# EasyEDA Pro project ±1250V.epro, board PCB1
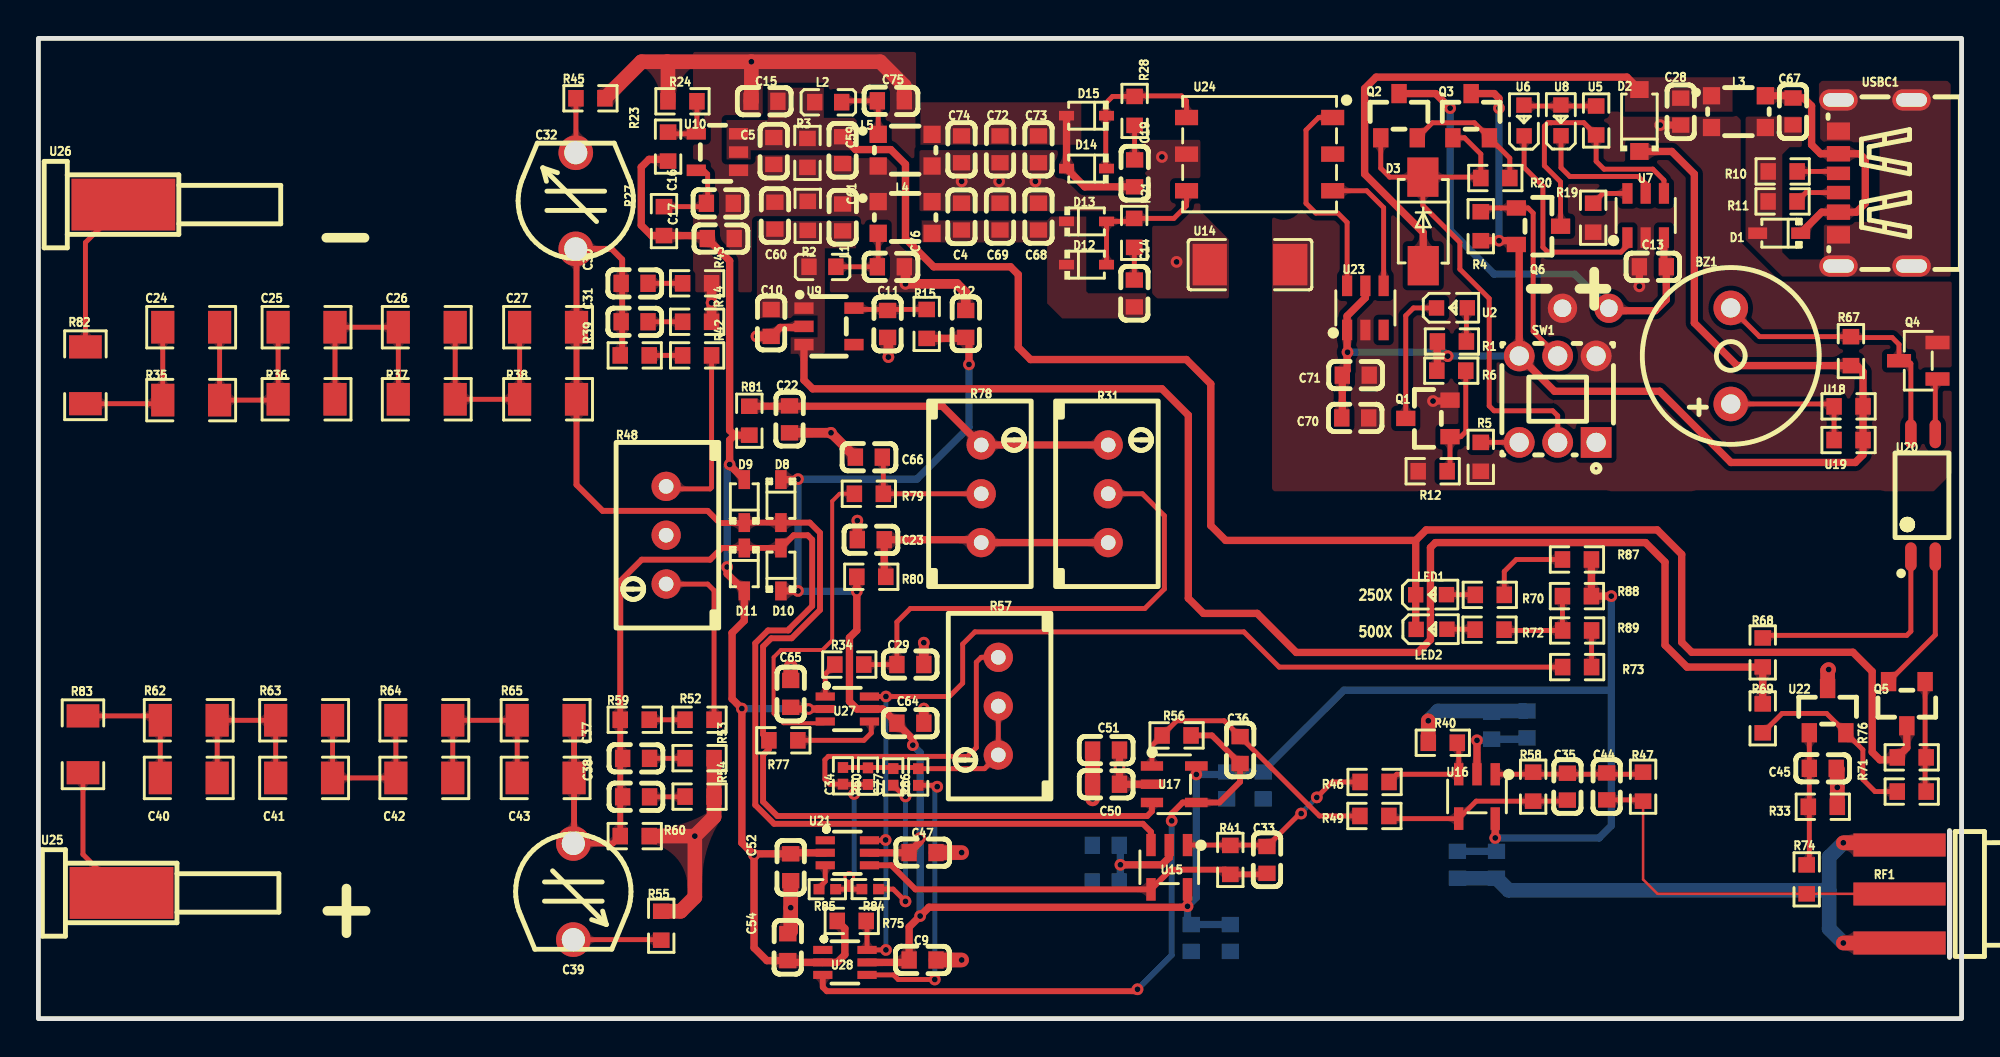
[diagram p3: board, top side]
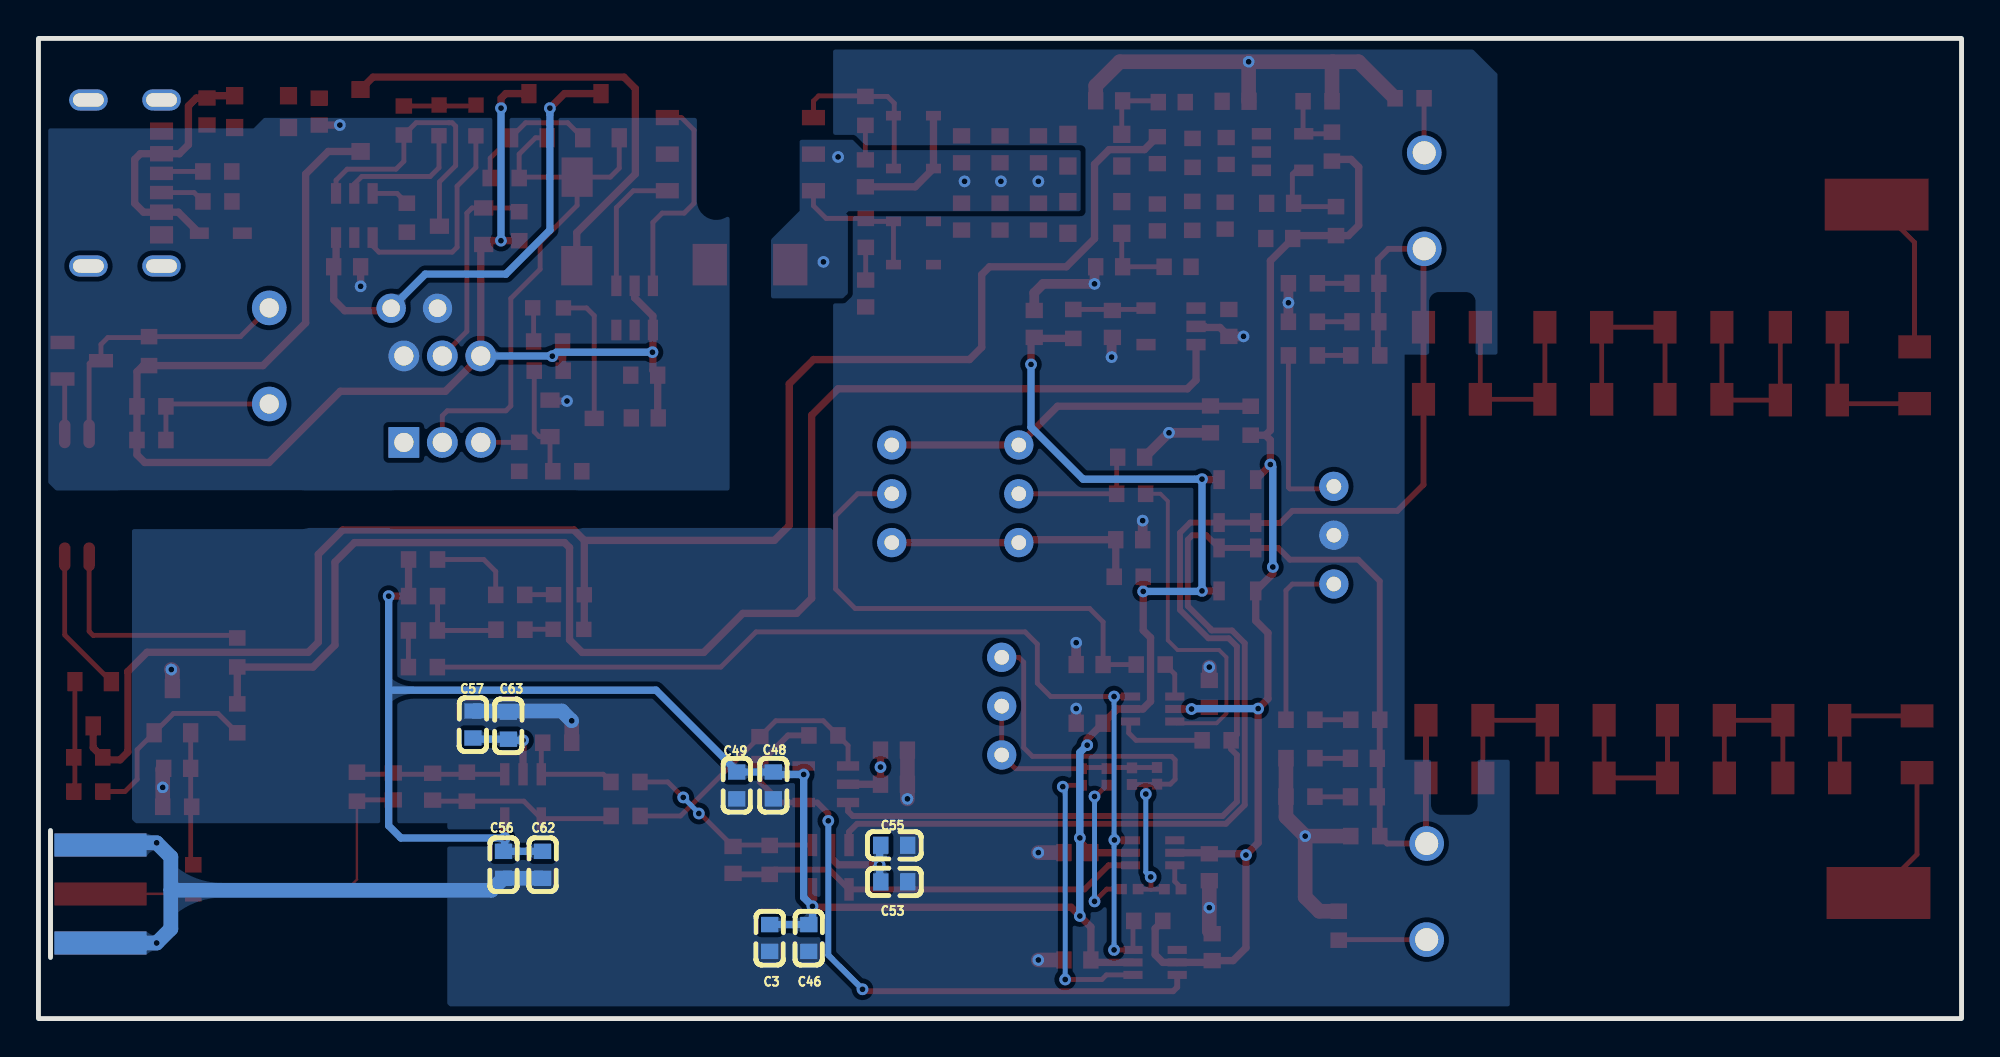
[diagram p4: board, bottom side, seen from below]

Outline 100 x 51 mm; copper layers: Top Layer, GND, PWR, Bottom Layer. Coordinates in mm from the lower left corner of the outline.
Outline path: rectangle 0,51 100,0
Stack: Top Layer 0.035mm 外层铜厚1oz / Dielectric1 0.0764mm 1080 RC67% 3.3mil / GND 0.0152mm 内层铜厚 / Dielectric2 1.265mm 1.3mm H/HOZ Copper / PWR 0.0152mm 内层铜厚 / Dielectric3 0.0764mm 1080 RC67% 3.3mil / Bottom Layer 0.035mm 外层铜厚1oz

## Design rules (mm)
net +2.5V: pwr
net SGND: pwr
net +VCC: pwr
net -4.5V: pwr
net +4.5V: pwr
net PGND: pwr
net BAT+: pwr
net -2.5V: pwr
net -VCC: pwr
net VSS_BIAS: pwr
net VCC_BIAS: pwr
net HV_IN-: SGN
net VBUS: pwr
net SIGNAL_A: SGN
net SIGNAL_D: SGN
net HV_IN+: SGN
net POWER_IN: pwr
net EGND: pwr
net +5V: pwr
template: 自定义配置
spacing copperThickness1oz (default): track to track 0.102, other pairs 0.152 to 0.3
spacing copperThickness2oz: track to track 0.203, other pairs 0.152 to 0.3
track width copperThickness1oz (default): min 0.025, default 0.254, max 2.54
track width pwr: min 0.203, default 0.381, max 2.54
track width sgn: min 0.127, default 0.305, max 2.54
track width GND: min 0.127, default 0.508, max 2.54
differential pair differentialPair (default): width min 0.127, default 0.254, max 2.54; gap min 0.152, default 0.152
via viaSize (default): diameter min 0.5, default 0.61, max 10; hole min 0.3, default 0.305, max 6.3
net class pwr uses pwr
net class SGN uses sgn
net +2.5V uses pwr
net GND uses GND
net SGND uses pwr
net +VCC uses pwr
net -4.5V uses pwr
net +4.5V uses pwr
net PGND uses pwr
net BAT+ uses pwr
net -2.5V uses pwr
net -VCC uses pwr
net VSS_BIAS uses pwr
net VCC_BIAS uses pwr
net HV_IN- uses sgn
net VBUS uses pwr
net SIGNAL_A uses sgn
net SIGNAL_D uses sgn
net HV_IN+ uses sgn
net POWER_IN uses pwr
net EGND uses pwr
net +5V uses pwr

## Placement (name value [footprint] x y rotation side)
BZ1  3kHz  [BUZ-TH_BD9.0-P5.00-D0.6-FD]  88 34.48 90 top
C3  1uF  [C0603]  61.98 4.19 90 bottom
C4  100nF  [C0603]  48 41.73 90 top
C5  22uF  [C0603]  38.24 45.14 90 top
C9  100nF  [C0603]  45.97 3.05 0 top
C10  10uF  [C0603]  38.1 36.19 90 top
C11  10uF  [C0603]  44.15 36.14 90 top
C12  10uF  [C0603]  48.22 36.14 270 top
C13  10uF  [C0603]  83.95 39.12 180 top
C14  1nF  [C0603]  56.98 37.73 270 top
C15  10uF  [C0603]  37.75 47.73 0 top
C16  10uF  [C0603]  35.43 42.42 180 top
C17  10uF  [C0603]  35.48 40.59 180 top
C19  1nF  [C0603]  57 43.98 270 top
C22  100nF  [C0603]  39.05 31.18 270 top
C23  100nF  [C0603]  43.28 24.91 180 top
C24  4.7pF  [R1206]  7.94 35.97 180 top
C25  4.7pF  [R1206]  13.94 35.97 180 top
C26  4.7pF  [R1206]  20.19 35.97 180 top
C27  2.2pF  [R1206]  26.5 35.97 180 top
C28  10uF  [C0603]  85.4 47.19 90 top
C29  100nF  [C0603]  45.34 18.42 0 top
C30  120pF  [C0603]  31 38.25 180 top
C31  100pF  [C0603]  31 36.25 180 top
C32  120pF  [CAP-TH_JML06]  27.94 42.55 90 top
C33  820pF  [C0603]  63.88 8.25 270 top
C34  100pF  [R0402]  41.83 12.63 270 top
C35  NC  [C0603]  79.5 12.06 270 top
C36  220pF  [C0603]  62.48 13.97 270 top
C37  120pF  [C0603]  31.08 13.54 0 top
C38  100pF  [C0603]  31.08 11.54 0 top
C39  120pF  [CAP-TH_JML06]  27.81 6.61 270 top
C40  4.7pF  [R1206]  7.81 12.52 180 top
C41  4.7pF  [R1206]  13.81 12.52 180 top
C42  4.7pF  [R1206]  20.06 12.52 180 top
C43  2.2pF  [R1206]  26.37 12.52 180 top
C44  22pF  [C0603]  81.55 12.08 90 top
C45  2.2pF  [C0603]  92.79 13.02 0 top
C46  1uF  [C0603]  59.94 4.19 90 bottom
C47  1uF  [C0603]  45.97 8.64 180 top
C48  100nF  [C0603]  61.79 12.13 270 bottom
C49  100nF  [C0603]  63.69 12.13 270 bottom
C50  100nF  [C0603]  55.51 12.19 180 top
C51  100nF  [C0603]  55.51 13.97 180 top
C52  1uF  [C0603]  39.12 7.87 90 top
C53  1uF  [C0603]  55.5 7.11 0 bottom
C54  100nF  [C0603]  38.97 3.71 90 top
C55  1uF  [C0603]  55.5 9.02 0 bottom
C56  100nF  [C0603]  73.79 8 270 bottom
C57  100nF  [C0603]  77.41 15.3 90 bottom
C59  22uF  [C0603]  41.82 45.18 90 top
C60  22uF  [C0603]  38.29 41.78 270 top
C61  22uF  [C0603]  41.82 41.68 270 top
C62  100nF  [C0603]  75.82 8 270 bottom
C63  100nF  [C0603]  75.57 15.24 90 bottom
C64  100nF  [C0603]  45.34 15.37 0 top
C65  100nF  [C0603]  39.12 16.89 90 top
C66  100nF  [C0603]  43.18 29.21 180 top
C67  10uF  [C0603]  91.24 47.2 90 top
C68  10uF  [C0603]  52 41.73 90 top
C69  10uF  [C0603]  50 41.73 90 top
C70  10uF  [C0603]  68.47 31.25 0 top
C71  100nF  [C0603]  68.5 33.48 0 top
C72  100nF  [C0603]  50 45.23 270 top
C73  10uF  [C0603]  52 45.23 270 top
C74  10uF  [C0603]  48 45.23 270 top
C75  22uF  [C0603]  44.32 47.75 180 top
C76  22uF  [C0603]  44.32 39.12 180 top
C77  47pF  [R0402]  44.45 12.57 270 top
D1  PESD5V0S1BA  [SOD-323_L1.7-W1.3-LS2.5-FD-1]  90.52 40.86 0 top
D2  B0520LW  [SOD-123_L2.7-W1.6-LS3.7-RD-4]  83.25 46.73 90 top
D3  SS34  [SMA_L4.3-W2.6-LS5.0-FD]  72 41.48 90 top
D8  1N4148WS  [SOD-323_L1.7-W1.3-LS2.5-FD-1]  38.61 26.92 90 top
D9  1N4148WS  [SOD-323_L1.7-W1.3-LS2.5-FD-1]  36.7 26.92 270 top
D10  1N4148WS  [SOD-323_L1.7-W1.3-LS2.5-FD-1]  38.61 23.37 270 top
D11  1N4148WS  [SOD-323_L1.7-W1.3-LS2.5-FD-1]  36.7 23.37 90 top
D12  B5819WS  [SOD-323_L1.7-W1.3-LS2.5-FD]  54.5 39.23 180 top
D13  B5819WS  [SOD-323_L1.7-W1.3-LS2.5-FD]  54.5 41.48 180 top
D14  B5819WS  [SOD-323_L1.7-W1.3-LS2.5-FD]  54.5 44.23 0 top
D15  B5819WS  [SOD-323_L1.7-W1.3-LS2.5-FD]  54.5 46.98 0 top
L1  2KΩ  [L0603]  40.77 39.12 180 top
L2  2KΩ  [L0603]  41.07 47.68 180 top
L3  WCM3225F2SF-601T10  [FILTER-SMD_4P-L3.2-W2.5-TL_PCAQ3225A]  88.4 47.19 0 top
L4  WCM3225F2SF-601T10  [FILTER-SMD_4P-L3.2-W2.5-TL_PCAQ3225A]  45.07 41.68 0 top
L5  WCM3225F2SF-601T10  [FILTER-SMD_4P-L3.2-W2.5-TL_PCAQ3225A]  45.07 45.18 0 top
LED1  GREEN  [LED0603-RD_GREEN]  72.42 22.05 0 top
LED2  BLUE  [LED0603-RD]  72.44 20.25 0 top
NOREF  -  [Pad_e197]  79.25 36.96 0 top
NOREF#2  -  [Pad_e196]  81.66 36.96 0 top
Q1  SS8050  [SOT-23_L2.9-W1.3-P1.90-LS2.4-BR]  72.25 31.23 0 top
Q2  AO3401A  [SOT-23_L2.9-W1.3-P1.90-LS2.4-BR]  70.75 46.98 270 top
Q3  AO3401A  [SOT-23_L2.9-W1.3-P1.90-LS2.4-BR]  74.5 46.98 270 top
Q4  SS8050  [SOT-23-3_L2.9-W1.3-P1.90-LS2.4-BR]  97.75 34.23 0 top
Q5  S8550  [SOT-23_L2.9-W1.3-P1.90-LS2.4-BR]  97.15 16.38 90 top
Q6  AO3401A  [SOT-23_L2.9-W1.3-P1.90-LS2.4-BR]  78 41.23 180 top
R1  1kΩ  [R0603]  73.5 35.23 0 top
R2  330Ω  [R0603]  40 41.77 270 top
R3  330Ω  [R0603]  39.99 45.04 90 top
R4  100kΩ  [R0603]  75 41.23 270 top
R5  47kΩ  [R0603]  75 29.23 90 top
R6  27kΩ  [R0603]  73.47 33.71 180 top
R10  5.1kΩ  [R0603]  90.7 44.08 0 top
R11  5.1kΩ  [R0603]  90.69 42.52 0 top
R12  4.7kΩ  [R0603]  72.5 28.48 0 top
R15  0Ω  [R0603]  46.19 36.14 270 top
R19  4.7kΩ  [R0603]  80.84 41.67 90 top
R20  100kΩ  [R0603]  75.76 43.73 180 top
R21  22Ω  [R0603]  56.98 40.88 270 top
R23  120kΩ  [R0603]  32.74 45.37 270 top
R24  110kΩ  [R0603]  33.49 47.73 180 top
R27  0Ω  [R0603]  32.53 41.49 270 top
R28  22Ω  [R0603]  57 47.23 270 top
R31  10KΩ  [RES-ADJ-TH_3296W]  55.63 27.3 0 top
R33  10kΩ  [R0603]  92.79 11.02 180 top
R34  10kΩ  [R0603]  42.16 18.42 0 top
R35  1MΩ  [R1206]  7.94 32.18 0 top
R36  1MΩ  [R1206]  13.94 32.22 0 top
R37  1MΩ  [R1206]  20.19 32.22 0 top
R38  1MΩ  [R1206]  26.5 32.22 0 top
R39  7.5kΩ  [R0603]  31.01 34.5 180 top
R40  402Ω  [R0603]  73.02 14.35 180 top
R41  402Ω  [R0603]  61.98 8.25 90 top
R42  402Ω  [R0603]  34.25 34.5 180 top
R43  10Ω  [R0603]  34.25 38.25 180 top
R44  10Ω  [R0603]  34.25 36.25 180 top
R45  10Ω  [R0603]  28.7 47.88 180 top
R46  402Ω  [R0603]  69.48 12.31 0 top
R47  50Ω  [R0603]  83.44 12.06 270 top
R48  500Ω  [RES-ADJ-TH_3296W]  32.64 25.15 180 top
R49  402Ω  [R0603]  69.47 10.54 0 top
R50  3.3kΩ  [R0402]  43.14 12.61 90 top
R52  402Ω  [R0603]  34.38 15.55 0 top
R53  10Ω  [R0603]  34.38 13.55 0 top
R54  10Ω  [R0603]  34.38 11.55 0 top
R55  10Ω  [R0603]  32.39 4.83 90 top
R56  402Ω  [R0603]  59.18 14.73 180 top
R57  20KΩ  [RES-ADJ-TH_3296W]  49.91 16.26 180 top
R58  402Ω  [R0603]  77.72 12.06 90 top
R59  7.5kΩ  [R0603]  31.01 15.55 0 top
R60  NC  [R0603]  31.01 9.49 0 top
R62  1MΩ  [R1206]  7.81 15.52 0 top
R63  1MΩ  [R1206]  13.81 15.52 0 top
R64  1MΩ  [R1206]  20.06 15.52 0 top
R65  1MΩ  [R1206]  26.37 15.52 0 top
R67  2.2kΩ  [R0603]  94.25 34.73 270 top
R68  2.2kΩ  [R0603]  89.66 19.05 270 top
R69  1kΩ  [R0603]  89.66 15.62 90 top
R70  2.2kΩ  [R0603]  75.47 22.05 180 top
R71  1kΩ  [R0603]  97.41 11.81 180 top
R72  2.2kΩ  [R0603]  75.46 20.23 180 top
R73  2.2kΩ  [R0603]  80.01 18.29 0 top
R74  5.1kΩ  [R0603]  91.95 7.24 90 top
R75  2.2kΩ  [R0603]  42.29 5.08 0 top
R76  18kΩ  [R0603]  97.41 13.59 0 top
R77  330kΩ  [R0603]  38.73 14.48 180 top
R78  10KΩ  [RES-ADJ-TH_3296W]  49.02 27.3 0 top
R79  10kΩ  [R0603]  43.18 27.3 0 top
R80  22Ω  [R0603]  43.31 22.99 0 top
R81  22Ω  [R0603]  36.97 31.11 90 top
R82  1kΩ  [R1206]  2.44 33.47 270 top
R83  1kΩ  [R1206]  2.31 14.27 90 top
R84  100Ω  [R0402]  43.25 6.74 0 top
R85  10Ω  [R0402]  41.02 6.73 0 top
R86  10Ω  [R0402]  45.75 12.57 270 top
R87  NC(250X)  [R0603]  80 23.88 180 top
R88  NC(500X)  [R0603]  80 21.98 180 top
R89  500x  [R0603]  80.01 20.19 180 top
RF1  BWSMA-KE-P001  [SMA-SMD_BWSMA-KE-P001]  96.77 6.48 0 top
SW1  TK-6580-1  [SW-TH_TK-6580-1]  79 32.23 270 top
U2  pwr  [LED0603-RD]  73.5 36.98 0 top
U5  1kΩ  [R0603]  81 46.73 90 top
U6  RED  [LED0603-RD]  77.25 46.73 90 top
U7  TP4057  [SOT-23-6_L2.9-W1.6-P0.95-LS2.8-BL]  83.58 41.78 0 top
U8  GREED  [LED0603-RD]  79.17 46.73 90 top
U9  ME6211C25M5G-N  [SOT-23-5_L3.0-W1.7-P0.95-LS2.8-BR]  41.11 36.02 180 top
U10  SGM2209-ADJXN5G/TR  [SOT-23-5_L2.9-W1.6-P0.95-LS2.8-BL]  35.31 45.08 90 top
U14  1nF  [C1808]  63 39.23 0 top
U15  SGM8061XN5/TR  [SOT-23-5_L3.0-W1.7-P0.95-LS2.8-BL]  58.8 7.87 180 top
U16  SGM8061XN5/TR  [SOT-23-5_L3.0-W1.7-P0.95-LS2.8-BL]  74.8 11.56 180 top
U17  SGM8061XN5/TR  [SOT-23-5_L3.0-W1.7-P0.95-LS2.8-BL]  59.05 12.19 270 top
U18  200Ω  [R0603]  94.12 31.85 0 top
U19  200Ω  [R0603]  94.12 30.1 0 top
U20  JC3H7C  [OPTO-SMD-4_L4.4-W2.7-P1.27-LS7.0-BR]  98 27.23 270 top
U21  BL1551B  [SC-70-6_L2.1-W1.3-P0.65-LS2.3-BR]  42.06 8.63 180 top
U22  TL432  [SOT-23_L2.9-W1.3-P1.90-LS2.4-BR]  93.04 16.02 270 top
U23  VPS8702  [SOT-23-6_L2.9-W1.6-P0.95-LS2.8-BL]  69 36.98 0 top
U24  0505 1W  [XFMR-SMD_6P-L8.0-W6.0-P1.91-LS8.4-TL]  63.5 44.98 270 top
U25  2mm香蕉头  [2MM香蕉头母座]  6.35 6.54 0 top
U26  2mm香蕉头  [2MM香蕉头母座]  6.45 42.35 0 top
U27  BL1551B  [SC-70-6_L2.1-W1.3-P0.65-LS2.3-BR]  42.06 16.11 180 top
U28  BL1551B  [SC-70-6_L2.1-W1.3-P0.65-LS2.3-BR]  41.94 2.92 180 top
USBC1  USB 3.1 C 6PF  [USB-C-SMD_TYPE-C-USB-13]  95.5 43.48 90 top

## Footprints (pads in the part's own frame, mm; a bottom-side part is the same pattern mirrored in y, then rotated)
2MM香蕉头母座
  rect 5.4x2.7 smd: 1(-2.032,0)
BUZ-TH_BD9.0-P5.00-D0.6-FD
  round 1.8 hole 1: 1(-2.5,0) 2(2.5,0)
C0603
  rect 0.8x0.9 smd: 1(-0.7,0) 2(0.7,0)
C1808
  rect 1.785x2.16 smd: 1(-2.092,0) 2(2.092,0)
CAP-TH_JML06
  round 1.8 hole 1.2: 1(-2.5,0) 2(2.5,0)
FILTER-SMD_4P-L3.2-W2.5-TL_PCAQ3225A
  rect 0.9x0.9 smd: 1(-1.4,0.825) 2(1.4,0.825) 3(1.4,-0.825) 4(-1.4,-0.825)
L0603
  rect 0.8x0.864 smd: 1(-0.7,0) 2(0.7,0)
LED0603-RD
  rect 0.8x0.8 smd: 1(-0.799,-0.004) 2(0.799,0.004)
LED0603-RD_GREEN
  rect 0.8x0.8 smd: 1(-0.799,-0.004) 2(0.799,0.004)
OPTO-SMD-4_L4.4-W2.7-P1.27-LS7.0-BR
  oval 1.5x0.6 smd: 1(3.2,-0.635) 2(3.2,0.635) 3(-3.2,0.635) 4(-3.2,-0.635)
Pad_e196
  round 1.524 hole 0.914: 1(0,0)
Pad_e197
  round 1.524 hole 0.914: 2(0,0)
R0402
  rect 0.566x0.54 smd: 1(-0.433,0) 2(0.433,0)
R0603
  rect 0.806x0.864 smd: 1(-0.753,0) 2(0.753,0)
R1206
  rect 1.208x1.701 smd: 1(-1.479,0) 2(1.479,0)
RES-ADJ-TH_3296W
  round 1.524 hole 0.762: 1(0,2.54) 2(0,0) 3(0,-2.54)
SC-70-6_L2.1-W1.3-P0.65-LS2.3-BR
  rect 1x0.42 smd: 1(1.15,-0.65) 2(1.15,0) 3(1.15,0.65) 4(-1.15,0.65) 5(-1.15,0) 6(-1.15,-0.65)
SMA-SMD_BWSMA-KE-P001
  rect 4.8x1.2 smd: 1(0,-2.55) 2(0,2.55) 5(0,0)
  rect 4.8x1.2 smd far side: 3(0,2.55) 4(0,-2.55)
SMA_L4.3-W2.6-LS5.0-FD
  rect 2.046x1.62 smd: 1(-2.304,-0.009) 2(2.304,0.009)
SOD-123_L2.7-W1.6-LS3.7-RD-4
  rect 0.88x0.96 smd: 1(-1.61,0) 2(1.61,0)
SOD-323_L1.7-W1.3-LS2.5-FD
  rect 0.78x0.5 smd: 1(-1.04,0) 2(1.04,0)
SOD-323_L1.7-W1.3-LS2.5-FD-1
  rect 0.985x0.6 smd: 1(-1.117,0) 2(1.117,0)
SOT-23-3_L2.9-W1.3-P1.90-LS2.4-BR
  rect 1.25x0.7 smd: 1(1,-0.95) 2(1,0.95) 3(-1,0)
SOT-23-5_L2.9-W1.6-P0.95-LS2.8-BL
  rect 0.6x1 smd: 1(-0.95,-1.1) 2(0,-1.1) 3(0.95,-1.1) 4(0.95,1.1) 5(-0.95,1.1)
SOT-23-5_L3.0-W1.7-P0.95-LS2.8-BL
  rect 0.49x1.157 smd: 1(-0.95,-1.153) 2(0,-1.153) 3(0.95,-1.153)
  rect 0.49x1.175 smd: 4(0.95,1.153) 5(-0.95,1.153)
SOT-23-5_L3.0-W1.7-P0.95-LS2.8-BR
  rect 1x0.6 smd: 1(1.3,-0.95) 2(1.3,0) 3(1.3,0.95) 4(-1.3,0.95) 5(-1.3,-0.95)
SOT-23-6_L2.9-W1.6-P0.95-LS2.8-BL
  rect 0.532x1.072 smd: 1(-0.95,-1.149) 2(0,-1.149) 3(0.95,-1.149) 4(0.95,1.149) 5(0,1.149) 6(-0.95,1.149)
SOT-23_L2.9-W1.3-P1.90-LS2.4-BR
  rect 1x0.8 smd: 1(1.15,-0.95) 2(1.15,0.95) 3(-1.15,0)
SW-TH_TK-6580-1
  rect 1.6x1.6 hole 1: 1(2.25,2)
  round 1.6 hole 1: 2(2.25,0) 3(2.25,-2) 4(-2.25,2) 5(-2.25,0) 6(-2.25,-2)
USB-C-SMD_TYPE-C-USB-13
  oval 1.1x2 hole 0.7x1.6: 1(-4.32,1.899) 2(-4.32,-1.901) 3(4.32,-1.901) 4(4.32,1.899)
  rect 0.7x1.2 smd: A5(-0.5,1.897) B5(0.5,1.897)
  rect 0.8x1.2 smd: A9(-1.52,1.899) B9(1.52,1.901)
  rect 0.9x1.2 smd: A12(-2.7,1.899) B12(2.7,1.899)
XFMR-SMD_6P-L8.0-W6.0-P1.91-LS8.4-TL
  rect 0.8x1.2 smd: 1(-1.905,3.8) 2(0,3.8) 3(1.905,3.8) 4(1.905,-3.8) 5(0,-3.8) 6(-1.905,-3.8)

## Nets
As in the schematic, except:
PGND: C13.2 C28.1 C70.2 C71.2 L3.4 NOREF.2 Q1.2 Q4.2 R5.1 R12.1 R19.1 SW1.4 U7.2 U14.2 U23.2
BAT+: C13.1 NOREF#2.1 Q2.3 U7.3

Pads without a net: SW1 1; U9 4; U21 1; U23 3; U24 2; U28 1

## Via types
v1: diameter 0.61, hole 0.305, Top Layer to Bottom Layer, 65 vias

## Routing (per net, layer and track width the routed paths; a pad name or vN(x,y) marks a point on that pad's centre or on a via; arc(x,y) is an arc through that point)
+2.5V: length 129.3
  Top Layer w0.381: v1(39.5,28.07) 39.47,28.04 38.61,28.04 ; R87.1 R88.1 v1(81.79,21.98) ; U15.5 v1(59.75,5.84) 59.7,5.79 46.3,5.79 v1(45.85,5.33) 45.27,4.76 C9.1 45.15,2.92 U28.5 ; v1(48.39,34.04) 48.39,35.27 C12.2 48.17,35.39 R15.2 ; R80.1 v1(42.55,22.22) 42.55,20.2 42.17,19.82 42.17,16.5 42.57,16.11 U27.5 43.9,16.11 C64.1 45.47,14.54 v1(45.47,14.23) ; U21.5 45.26,8.63 C47.2 45.85,9.21 v1(45.85,9.4) ; U16.5 v1(75.75,9.4) ; U17.5 v1(60.21,12.7) ; D10.2 v1(39.5,22.25)
  Bottom Layer w0.381: 81.79,17.09 81.79,10.03 81.15,9.4 v1(75.75,9.4) 75.75,8.77 C62.1 C56.1 ; 81.79,17.09 67.89,17.09 63.69,12.89 C49.1 C48.1 61.66,12.7 v1(60.21,12.7) 60.21,6.3 v1(59.75,5.84) 59.75,5.08 C46.2 C3.2 ; 81.79,17.09 v1(81.79,21.98) ; v1(45.85,5.33) v1(45.85,9.4) 45.85,13.84 v1(45.47,14.23) ; v1(48.39,34.04) 48.39,30.77 45.68,28.07 v1(39.5,28.07) v1(39.5,22.25) 39.52,22.22 v1(42.55,22.22)
+4.5V: length 75.5
  Top Layer w0.381: U9.3 39.81,33.22 40.26,32.77 58.42,32.77 59.79,31.39 59.79,21.87 60.58,21.08 63.37,21.08 65.4,19.05 71.73,19.05 72.38,19.71 72.38,24.5 72.64,24.77 83.57,24.77 84.58,23.75 84.58,19.43 85.73,18.29 89.65,18.29 R68.2 R69.2
+5V: length 80.8
  Top Layer w0.381: C70.1 67.8,31.28 C71.1 68.05,33.73 U23.1 68.05,36.55 69,37.5 U23.5 ; R1.1 72.75,34.47 ; 72.75,34.47 72.75,33.74 R6.2 ; 72.75,34.47 v1(73.28,34.47) ; D2.1 84.93,45.12 86.11,43.94 86.11,36.19 88.33,33.97 94.56,33.97 94.88,33.66 U18.2 U19.2 94.88,29.34 94.47,28.93 88.01,28.93 84.3,32.64 78.84,32.64 SW1.6 77,40.13 Q6.2 76.65,40.47 v1(75.95,40.47) 75,40.47 ; v1(75.95,47.37) 75.95,47.88 75.7,48.13 Q3.3
  Bottom Layer w0.381: v1(75.95,47.37) 75.95,47.37 v1(75.95,40.47) ; SW1.6 73.29,34.48 v1(73.28,34.47) 73.07,34.67 v1(68.07,34.67)
-2.5V: length 96.3
  Top Layer w0.381: C65.1 39.2,16.11 v1(40.04,16.11) U27.2 ; R23.2 32.65,44.7 31.75,44.7 31.35,44.3 31.35,41.27 31.88,40.74 R27.2 34.63,40.74 C17.2 35.94,39.42 35.94,30.61 36.2,30.35 ; 36.2,30.35 35.94,30.1 35.94,28.8 36.7,28.04 ; 36.2,30.35 R81.1 ; R75.1 41.93,4.68 41.93,3.33 41.53,2.92 U28.2 39.06,2.92 C54.1 37.88,3.02 37.21,3.68 v1(37.21,8.51) ; v1(37.21,8.51) 36.58,9.14 v1(36.58,16.13) 36.07,16.64 36.07,20.07 36.7,20.7 D11.1 35.81,23.14 v1(35.81,23.49) ; v1(37.21,8.51) 37.28,8.57 C52.2 39.17,8.63 U21.2 ; U16.2 v1(74.8,14.48) ; C51.1 v1(56.21,13.08) C50.1 U17.2 ; U15.2 58.8,8.38 58.42,8 v1(56.26,8)
  PWR w0.381: v1(40.04,16.11) 40.04,15.2 40.26,14.99 51.43,14.99 53.34,13.08 v1(56.21,13.08)
  Bottom Layer w0.381: C57.1 77.35,14.54 C63.1 75.5,14.48 v1(74.8,14.48) ; 56.2,9.02 56.26,8.96 v1(56.26,8) 56.26,7.17 C53.2 ; v1(36.58,16.13) 40.02,16.13 v1(40.04,16.11) ; v1(35.81,23.49) 35.81,28.7 v1(35.94,28.83)
-4.5V: length 89.2
  Top Layer w0.381: LED2.1 71.62,20.27 LED1.1 71.62,24.88 ; 71.62,24.88 72.16,25.42 84.18,25.42 85.45,24.15 85.45,19.58 85.97,19.06 94.35,19.06 95.35,18.06 95.35,13.87 95.76,13.46 96.53,13.46 R76.1 97.15,14.09 Q5.3 ; 71.62,24.88 61.73,24.88 60.96,25.65 60.96,33.02 59.69,34.29 51.58,34.29 50.95,34.92 50.95,38.71 50.55,39.12 46.55,39.12 45.08,40.58 45.08,44.45 44.32,45.21 42.49,45.21 C59.2
-VCC: length 6.7
  Top Layer w0.381: C19.2 54.41,43.28 D14.1 D15.1
GND: length 107
  Top Layer w0.381: U9.2 39.38,36.02 39.32,35.96 38.56,35.96 C10.1
  Top Layer w0.508: R44.1 v1(35,37.24) R43.1 ; C29.2 v1(46.04,19.56) ; C10.1 v1(37.34,35.49) ; C12.1 48.22,37.76 47.75,38.23 v1(45.08,38.23) 45.08,39.05 C76.1 ; v1(44.2,34.42) 44.2,35.4 C11.1 ; C23.2 v1(42.58,25.91) ; C64.2 v1(46.04,16.13) ; C22.2 v1(41.21,30.48) C66.2
  Top Layer w0.762: v1(34.13,9.49) 34.13,6.32 33.4,5.58 R55.2 ; v1(34.13,9.49) 35.13,10.49 R54.2 R53.2 ; v1(34.13,9.49) R60.2 ; v1(54.81,11.43) C50.2 C51.2 ; C65.2 v1(39.12,18.29) ; R40.2 v1(72.27,15.49) ; RF1.1 v1(93.85,3.93) ; v1(93.09,18.16) 93.04,18.11 U22.3 ; v1(93.85,9.14) 96.66,9.14 RF1.2 ; v1(37.07,49.78) 43.77,49.78 45.02,48.53 C75.1 ; v1(37.07,49.78) 32.69,49.78 ; v1(37.07,49.78) 37.07,47.75 C15.1 ; C52.1 v1(39.12,5.77) 39.12,4.56 C54.2 ; R45.1 31.36,49.78 32.69,49.78 ; 32.69,49.78 32.73,49.74 R24.2 ; C47.1 v1(48.01,8.64) ; R33.1 v1(93.54,12.03) 93.54,12.97 C45.2 ; C9.2 v1(48.01,3.05)
  Bottom Layer w0.762: 93.12,6.67 93.12,4.67 v1(93.85,3.93) RF1.1 ; 93.12,6.67 93.12,8.41 v1(93.85,9.14) 96.66,9.14 RF1.2 ; 93.12,6.67 76.45,6.67 C62.2 C56.2 ; C57.2 72.78,16 v1(72.27,15.49)
PGND: length 3
  Top Layer w0.381: v1(72.52,32.13) 73.35,32.13 Q1.2 ; C28.1 v1(84.33,46.49) ; C13.2 v1(83.25,38.1)
SGND:
  vias: v1(48.01,43.56) v1(49.95,43.56) v1(51.84,43.56) v1(58.42,44.83) v1(59.18,39.37)
VBUS: length 25.3
  Top Layer w0.381: D3.1 72.01,40.89 68.96,43.94 68.96,48.39 69.56,48.98 82.6,48.98 D2.2
VCC_BIAS: length 13.7
  Top Layer w0.381: 44.06,22.99 43.98,23.07 C23.1 48.87,24.91 R78.3 R31.3
VSS_BIAS: length 19.5
  Top Layer w0.381: R31.1 R78.1 47.01,31.86 R81.2
50X_BIAS_IN: length 17.8
  Top Layer w0.203: U27.3 40.82,15.37 38.73,15.37 38.23,15.88 38.23,18.8 38.61,19.18 40.77,19.18 41.27,19.68 41.27,26.92 41.66,27.3 R79.1
500X_BIAS_IN: length 1.9
  Top Layer w0.254: U27.1 40.91,17.92 R34.1
BAT+: length 25.8
  Top Layer w0.381: Q2.3 72.65,48.13 v1(73.41,47.37) ; U7.3 84.52,39.24 C13.1 84.65,37.4 84.07,36.83 81.79,36.83 NOREF#2.1
  Bottom Layer w0.381: v1(73.41,47.37) 73.41,41.02 75.69,38.73 79.88,38.73 NOREF#2.1
BAT_CHRG: length 14.6
  Top Layer w0.254: U7.4 84.52,43.62 83.95,44.2 81.41,44.2 81,44.6 U5.1 80.36,46.61 78.66,46.61 78.65,46.61 78.49,46.61 78.31,46.43 78.31,44.38 79.15,43.53 Q6.3
BIAS_OUT: length 4.6
  Top Layer w0.254: 39.49,14.48 42.93,14.48 43.31,14.86 43.31,15.36 U27.4
HV_IN+: length 70.8
  Top Layer w0.305: R65.2 C43.1 27.85,9.15 C39.1 29.87,9.11 R60.1 R59.1 30.25,22.76 31.37,23.88 34.92,23.88 35.53,24.49 38.61,24.49 39.27,25.15 40.01,25.15 40.23,24.92 40.23,21.46 39.05,20.28 39.05,20.25 38.99,20.19 37.94,20.19 37.27,19.53 37.27,11.11 38.25,10.13 57.43,10.13 57.85,9.71 U15.3
HV_IN-: length 70.9
  Top Layer w0.305: U17.3 57.9,10.78 57.66,10.54 38.42,10.54 37.68,11.28 37.68,13.72 37.98,14.02 R77.2 37.68,14.78 37.68,19.36 38.1,19.79 39.16,19.79 40.64,21.26 40.64,25.27 40.11,25.81 D8.1 D9.2 36.68,25.78 35.43,25.78 34.8,26.42 29.34,26.42 27.98,27.77 R38.2 C27.1 27.98,40.01 C32.1 29.8,40.05 30.35,39.5 30.35,34.6 R39.2
POWER_IN: length 14
  Top Layer w0.381: L3.2 91.12,48.01 C67.2 91.79,47.9 92.2,47.48 92.2,45.47 92.67,45 USBC1.B9 94.7,45 95,44.7 95,42.42 94.53,41.96 USBC1.A9 92.73,41.96 D1.2
SET_EN: length 56
  Top Layer w0.254: 43.04,5.08 43.09,5.04 U28.6 v1(44.07,3.57) ; R73.1 64.52,18.29 62.68,20.12 48.69,20.12 48.06,19.48 48.06,17.45 47.36,16.76 v1(44.07,16.76) U27.6 ; U21.6 44.07,9.28
  Bottom Layer w0.254: v1(44.07,16.76) 44.07,9.31 v1(44.05,9.29) 44.07,9.28 v1(44.07,3.57)
SIGNAL_A: length 21.7
  Top Layer w0.305: U21.4 44.35,7.98 45.6,6.72 U15.4 58.88,7.75 61.73,7.75 61.98,7.5 63.83,7.5 C33.2
SIGNAL_B: length 1.4
  Top Layer w0.254: U21.3 40.91,7.14 40.59,6.81 R85.1
SIGNAL_C: length 14.7
  Top Layer w0.254: U28.4 44.46,2.27 44.7,2.03 v1(46.61,2.03) ; v1(46.74,12.06) 46.67,12.14 R86.2
  Bottom Layer w0.254: v1(46.61,2.03) 46.61,11.94 v1(46.74,12.06)
SIGNAL_D: length 35.4
  Top Layer w0.305: v1(57.15,1.52) 57.05,1.42 40.99,1.42 40.79,1.63 U28.3 ; v1(58.93,10.29) 58.93,10.67 59.5,11.24 U17.4 61.41,11.24 62.48,12.32 C36.2 61.02,14.73 R56.1
  Bottom Layer w0.305: v1(57.15,1.52) 58.93,3.3 v1(58.93,10.29)
SIGNAL_OUT: length 19.6
  Top Layer w0.127: RF1.5 96.77,6.49 84.19,6.49 83.44,7.24 R47.2
  Top Layer w0.254: C44.1 83.37,11.38 R47.2
$1N592: length 6
  Top Layer w0.254: R12.2 73.4,28.62 Q1.1 73.96,30.28 74.22,30.53 74.22,33.71
$1N593: length 7.1
  Top Layer w0.254: U2.1 71.5,36.97 71.1,36.57 Q1.3
$1N596: length 1.8
  Top Layer w0.254: U2.2 74.25,36.93 R1.2
$1N610: length 2.2
  Top Layer w0.254: USBC1.B5 93.5,44.08 R10.2
$1N611: length 2.3
  Top Layer w0.254: USBC1.A5 91.91,42.98 R11.2
$1N1058: length 2
  Top Layer w0.254: U7.6 81.35,42.93 R19.2
$1N1060: length 11.3
  Top Layer w0.254: U7.1 82.62,40.21 82.3,39.88 78.49,39.88 78.23,40.13 78.23,43.31 77.25,44.29 U6.1
$1N1061: length 6.9
  Top Layer w0.254: U8.1 79.17,44.27 79.63,43.81 83.18,43.81 83.58,43.42 U7.5
$1N1063: length 3.8
  Top Layer w0.254: U6.2 77.29,47.48 U5.2
$1N1557: length 6.9
  Top Layer w0.254: Q2.2 72.48,46.61 74.67,46.61 Q3.2 76.51,44.77 76.51,43.73
$1N1559: length 28.5
  Top Layer w0.254: Q2.1 69.8,44.25 70.27,43.78 D3.2 ; Q3.1 74.15,45.83 75,44.98 R20.2 74.96,43.78 D3.2 ; D3.2 71.99,42.31 73.91,40.39 73.91,38.99 75.44,37.46 75.44,31.88 75.69,31.62 78.74,31.62 79,31.36 SW1.2
$1N1562: length 2
  Top Layer w0.254: SW1.3 77,29.98 R5.2
$1N1563: length 10.9
  Top Layer w0.254: R4.1 75.2,42.18 Q6.1 77.46,42.18 77.72,41.91 77.72,35.75 SW1.5
$1N2149: length 1.7
  Top Layer w0.254: R21.2 56.98,40.12 C14.1
$1N2150: length 1.8
  Top Layer w0.254: C19.1 R28.2
$1N3420: length 11.3
  Top Layer w0.254: U24.1 66.57,46.88 65.91,46.23 65.91,42.42 66.42,41.91 67.56,41.91 68.05,41.42 U23.6
$1N3428: length 7.1
  Top Layer w0.254: U24.3 69.07,43.07 69.95,42.19 U23.4
$1N4101: length 3.9
  Top Layer w0.254: L4.4 43.67,39.16 C76.2 L1.1
$1N4102: length 3.6
  Top Layer w0.254: L2.1 41.84,47.75 C75.2 43.67,47.71 L5.1
$1N4646: length 3.8
  Top Layer w0.254: U9.5 42.48,36.9 46.19,36.9
$1N4655: length 4.5
  Top Layer w0.254: 34.21,44.13 34.61,44.13 34.8,43.94 34.8,42.48 C16.2 34.56,42.25 R27.1
$1N4658: length 3.2
  Top Layer w0.254: R24.1 34.24,46.07 34.21,46.03 32.83,46.03 R23.1
$1N9258: length 7.5
  Top Layer w0.254: U24.4 59.7,42.29 59.04,41.63 R21.1 56.82,41.48 D13.1 D12.1
$1N9268: length 8.7
  Top Layer w0.254: U24.6 59.7,47.74 59.44,48.01 57.03,48.01 R28.1 55.85,47.98 55.5,47.62 55.5,44.27 D14.2
$2N1303: length 4.6
  Top Layer w0.254: R55.1 32.35,4.11 C39.2
$2N1309: length 1.8
  Top Layer w0.254: C30.1 33.5,38.25
$2N1310: length 1.9
  Top Layer w0.254: C38.2 33.61,11.54 R54.1
$2N1311: length 1.9
  Top Layer w0.254: C37.2 33.61,13.54 R53.1
$2N1313: length 2.8
  Top Layer w0.254: C32.2 27.95,45.06 R45.2
$2N1314: length 1.8
  Top Layer w0.254: C31.1 33.5,36.25
$2N1315: length 9.4
  Top Layer w0.254: R52.2 35.13,22.27 34.8,22.61 32.64,22.61 32.64,22.61
$2N1316: length 1.9
  Top Layer w0.254: R59.2 R52.1
$2N1317: length 9.3
  Top Layer w0.254: R42.1 35,27.64 34.92,27.56 32.77,27.56 R48.3
$2N1318: length 1.7
  Top Layer w0.254: R39.1 33.5,34.5
$2N1320: length 9.4
  Top Layer w0.254: C42.1 R64.2 24.89,15.52 24.89,12.52
$2N1321: length 9.3
  Top Layer w0.254: R63.2 C41.1 C42.2 R64.1
$2N1322: length 9
  Top Layer w0.254: C41.2 R63.1 R62.2 C40.1
$2N1323: length 7.1
  Top Layer w0.254: R83.2 6.11,15.75 R62.1 C40.2
$2N1324: length 7.1
  Top Layer w0.254: 4.32,6.54 2.31,8.54 R83.1
$2N1325: length 7.9
  Top Layer w0.254: C24.2 R35.1 6.28,31.99 R82.2
$2N1326: length 8.2
  Top Layer w0.254: R82.1 2.44,40.38 U26.1
$2N1327: length 10.6
  Top Layer w0.254: 9.42,35.97 9.42,32.18 12.42,32.18 R36.1 C25.2
$2N1328: length 10.8
  Top Layer w0.254: 15.42,32.22 15.42,35.97 C26.2 R37.1
$2N1329: length 10.9
  Top Layer w0.254: C27.2 R38.1 R37.2 C26.1
$2N2579: length 7.7
  Top Layer w0.254: U16.1 83.33,12.71 R47.1
$2N2580: length 14.5
  Top Layer w0.254: U17.1 57.9,14.2 R56.2 59.19,15.49 61.66,15.49 C36.1 66.61,10.54 R49.1
$2N2581: length 10.4
  Top Layer w0.254: R46.1 67.28,12.31 v1(66.47,11.51) ; U15.1 63.81,9.03 C33.1 65.59,10.67 v1(65.66,10.67)
  Bottom Layer w0.254: v1(65.66,10.67) 65.66,10.69 v1(66.47,11.51)
$2N2583: length 5.5
  Top Layer w0.254: R46.2 70.63,12.71 U16.3 73.85,14.28 R40.1
$2N2584: length 9.7
  Top Layer w0.254: C35.2 79.45,11.31 R58.1 74.76,11.31 U16.4 70.36,10.4 R49.2
$3N663: length 25.8
  Top Layer w0.254: R34.2 C29.1 44.64,20.64 45.34,21.34 57.53,21.34 58.55,22.35 58.55,26.16 57.4,27.3 R31.2
$3N671: length 7
  Top Layer w0.254: R78.2 R79.2 43.93,29.16 C66.1
$3N1077: length 4.5
  Top Layer w0.254: R70.1 76.22,23.26 76.84,23.88 R87.2
$3N1079: length 4.9
  Top Layer w0.254: R88.2 79.25,20.2 R89.2 76.25,20.19 76.21,20.23
$3N1082: length 1.9
  Top Layer w0.254: R73.2 R89.1
$3N1094: length 1.5
  Top Layer w0.254: LED1.2 74.7,22.06 R70.2
$3N1095: length 1.5
  Top Layer w0.254: LED2.2 74.68,20.26 R72.2
$3N1360: length 24.1
  Top Layer w0.254: 42.44,12.18 41.85,12.18 C34.2 41.14,12.2 40.89,12.45 40.89,13.46 41.07,13.64 48.31,13.64 48.77,14.1 48.77,18.54 49.02,18.8 49.91,18.8 ; 42.44,12.18 42.42,12.16 v1(42.42,11.68) ; 42.44,12.18 R50.1 ; v1(42.16,7.37) 42.15,7.35 42.15,6.73 ; 42.15,6.73 42.81,6.73 R84.1 ; 42.15,6.73 41.45,6.73
  Bottom Layer w0.254: v1(42.16,7.37) 42.42,7.62 v1(42.42,11.68)
$3N1361: length 10.9
  Top Layer w0.254: R57.2 R57.1 49.2,13 R86.1 45.69,13.06 C34.1
$3N1362: length 8
  Top Layer w0.254: v1(45.08,11.56) 45.03,11.56 44.45,12.14 ; R84.2 44.44,6.74 v1(45.08,6.1)
  Bottom Layer w0.254: v1(45.08,11.56) v1(45.08,6.1)
$3N1878: length 6.9
  Top Layer w0.254: U22.1 C45.1 92.09,8.13 R74.2
$3N1883: length 10
  Top Layer w0.254: R71.2 95.5,11.81 94.87,12.45 94.87,13.99 U22.2 92.98,15.88 90.67,15.88 R69.1
$3N1884: length 11.7
  Top Layer w0.254: R68.1 89.8,19.94 97.15,19.94 97.36,20.15 U20.1
$3N1886: length 5.7
  Top Layer w0.254: R71.1 98.11,11.87 Q5.1
$3N1888: length 2.9
  Top Layer w0.254: Q4.1 98.63,33.16 U20.3
$3N1890: length 14.7
  Top Layer w0.254: BZ1.2 89.5,35.48 R67.1 94.3,35.43 96.39,35.43 96.75,35.08 Q4.3 97.22,34.23 97.36,34.08 U20.4
$3N1892: length 7.5
  Top Layer w0.254: U20.2 98.63,19.96 Q5.2
$3N1894: length 7.2
  Top Layer w0.254: U19.1 U18.1 93.25,31.98 BZ1.1

## Copper pours and planes (outline as drawn; the poured copper is in the pictures)
+2.5V on PWR: 42.42,1.02 42.42,10.92 49.15,10.92 49.15,6.01 49.98,5.18 57.93,5.18 58.93,6.18 58.93,13.53 71.77,13.53 73.64,11.67 79.39,11.67 79.5,11.78 79.5,16.91 79.33,17.09 52.45,17.09 52.45,15.72 41.68,15.72 41.68,17.01 38.17,17.01 38.17,36.44 42.3,36.44 42.36,36.38 49.91,36.38 49.91,34.54 50.93,33.53 52.45,33.53 52.45,33.4 58.17,33.4 60.45,31.11 60.45,25.53 60.2,25.27 61.07,24.4 83.93,24.4 86.11,22.22 86.11,1.4 85.73,1.02
+4.5V on Top Layer: 37.36,41.5 42.52,41.5 42.52,34.59 37.36,34.59
+5V on PWR: 65.66,49.4 65.66,29.52 67.39,27.79 95.5,27.79 96.39,28.68 96.39,35.65 95.85,36.19 88.78,36.19 87.63,37.35 87.63,45.59 83.82,49.4
+VCC on Top Layer: 45.92,41.73 57.6,41.73 57.6,36.43 45.92,36.43
-2.5V on PWR: 32.77,0.57 32.77,39.24 30.1,39.24 30.1,45.34 30.13,45.37 32.74,45.37 32.74,45.42 37.59,45.42 37.59,15.24 37.68,15.32 42.33,15.32 42.27,15.26 53.21,15.26 53.21,16.76 78.74,16.76 78.87,16.64 78.87,13.91 58.36,13.91 58.36,6.22 50.04,6.22 50.04,11.21 42.16,11.21 42.16,0.76 41.97,0.57
-4.5V on Top Layer: 35.78,48.44 42.55,48.44 42.55,44.7 35.78,44.7
-VCC on Top Layer: 45.86,47.68 54.23,47.68 54.23,45.47 45.86,45.47
GND on Top Layer: 34.04,50.29 45.64,50.29 45.64,37.79 34.04,37.79
GND on Bottom Layer: 58.67,50.42 25.4,50.42 24.13,49.15 24.13,34.54 28.96,34.54 28.96,13.46 23.5,13.46 23.5,13.46 23.5,0.63 78.61,0.63 78.74,0.76 78.74,10.16 94.94,10.16 95.14,10.36 95.14,25.51 95.12,25.53 58.8,25.53 58.67,25.4
GND on GND: 58.67,50.29 25.4,50.29 24.13,49.02 24.13,34.42 28.96,34.42 28.96,13.33 23.5,13.33 23.5,13.33 23.5,0.51 99.71,0.51 99.71,25.4 58.8,25.4 58.67,25.27
PGND on Top Layer: 88.1,47.19 64.31,47.19 64.15,47.03 64.15,27.55 64.26,27.43 98.55,27.43 99.57,28.45 99.57,46.64 88.65,46.64
PGND on Bottom Layer: 88.27,46.86 64.48,46.86 64.06,46.45 64.06,27.47 99.09,27.47 99.74,28.12 99.74,46.31 88.81,46.31
PGND on GND: 88.39,49.1 64.01,49.09 64.01,27.43 98.55,27.43 99.57,28.45 99.57,38.38 88.39,38.38
SGND on Top Layer: 45.81,45.18 57.12,45.18 57.66,45.72 60.42,45.72 60.42,42.02 61.91,40.54 61.91,37.54 61.98,37.47 58.17,37.47 57.91,37.72 57.91,41.97 57.88,42.01 45.81,42.01
SGND on Bottom Layer: 57.12,45.18 57.66,45.72 60.42,45.72 60.42,42.02 61.91,40.54 61.91,37.54 61.98,37.47 58.17,37.47 57.91,37.72 57.91,41.8 58,41.89 57.88,42.01 45.81,42.01 45.81,45.18
SGND on GND: 57.12,45.18 57.66,45.72 60.42,45.72 60.42,42.02 61.91,40.54 61.91,37.47 58.17,37.47 57.91,37.72 57.91,42.01 45.81,42.01 45.81,45.18
VBUS on Top Layer: 82.5,48.98 88.1,48.98 88.1,47.18 82.5,47.18
EGND on Top Layer: 91.69,46.93 88.77,46.93 88.77,40.51 90.68,38.61 99.44,38.61 99.44,48.61 99.27,48.79 92.73,48.79 92.58,48.64 92.58,45.85 92.84,45.59 95.65,45.59 95.74,45.51 95.74,41.45 95.74,41.45 92.89,41.45 92.84,41.4 92.84,39.5 91.06,39.5 90.68,39.88 90.68,44.96 91.06,45.34 91.69,45.34
EGND on GND: 88.65,49.15 100.84,49.15 100.84,38.48 88.65,38.48

Small or netless copper shapes (teardrops, artwork), in the pictures only: 501 on Top Layer, 71 on Bottom Layer, 3 on PWR

## Text on the board
Top Silkscreen Layer: 250X | 500X | - | +
